# EAGLE design ch446q-breakout (EAGLE 7.7.0)
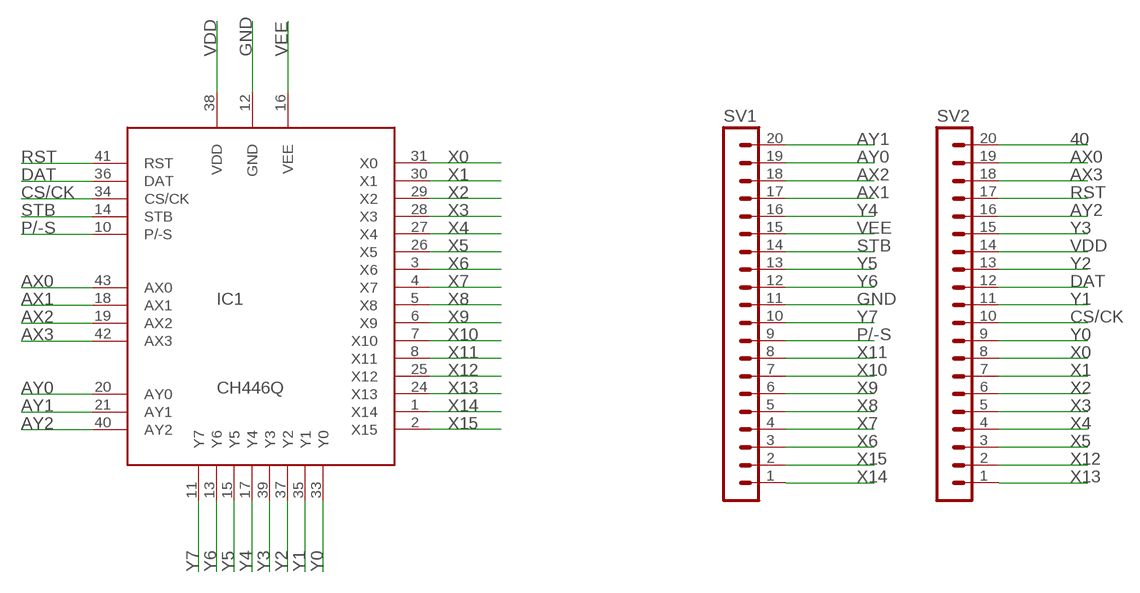
[diagram p0: schematic, sheet 1]

## Parts
IC1  CH446Q  [LQFP-44-J]
SV1  MA20-1JC  [MA20-1J]
SV2  MA20-1JC  [MA20-1J]

## Nets
40: SV2.20
AX0: IC1.43(AX0) SV2.19
AX1: IC1.18(AX1) SV1.17
AX2: IC1.19(AX2) SV1.18
AX3: IC1.42(AX3) SV2.18
AY0: IC1.20(AY0) SV1.19
AY1: IC1.21(AY1) SV1.20
AY2: IC1.40(AY2) SV2.16
CS/CK: IC1.34(CS/CK) SV2.10
DAT: IC1.36(DAT) SV2.12
GND: IC1.12(GND) SV1.11
P/-S: IC1.10(P/-S) SV1.9
RST: IC1.41(RST) SV2.17
STB: IC1.14(STB) SV1.14
VDD: IC1.38(VDD) SV2.14
VEE: IC1.16(VEE) SV1.15
X0: IC1.31(X0) SV2.8
X1: IC1.30(X1) SV2.7
X2: IC1.29(X2) SV2.6
X3: IC1.28(X3) SV2.5
X4: IC1.27(X4) SV2.4
X5: IC1.26(X5) SV2.3
X6: IC1.3(X6) SV1.3
X7: IC1.4(X7) SV1.4
X8: IC1.5(X8) SV1.5
X9: IC1.6(X9) SV1.6
X10: IC1.7(X10) SV1.7
X11: IC1.8(X11) SV1.8
X12: IC1.25(X12) SV2.2
X13: IC1.24(X13) SV2.1
X14: IC1.1(X14) SV1.1
X15: IC1.2(X15) SV1.2
Y0: IC1.33(Y0) SV2.9
Y1: IC1.35(Y1) SV2.11
Y2: IC1.37(Y2) SV2.13
Y3: IC1.39(Y3) SV2.15
Y4: IC1.17(Y4) SV1.16
Y5: IC1.15(Y5) SV1.13
Y6: IC1.13(Y6) SV1.12
Y7: IC1.11(Y7) SV1.10

## Library data of the parts
IC1 = joakim:CH446Q: 8x16 matrix analog switch chip, contains 128 analog switches, used for arbitrary routing of 8x16 signal channels. CH446 supports 4V to 12V single supply voltage, and supports +5V and -7V dual power supply voltage. The ON resistance is not greater than 65Ω. https://www.wch-ic.com/downloads/CH446DS1_PDF.html
SV1 SV2 = joakim:MA20-1J: PIN HEADER; OC_FARNELL: unknown; OC_NEWARK: unknown

## Board
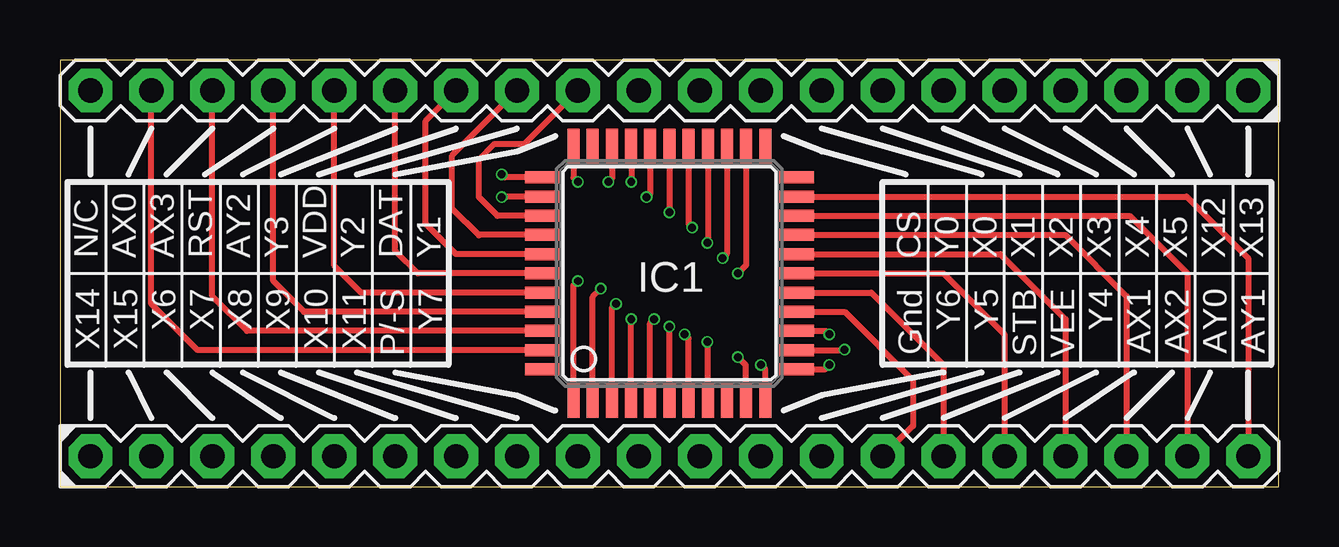
[diagram p1: board, top side]
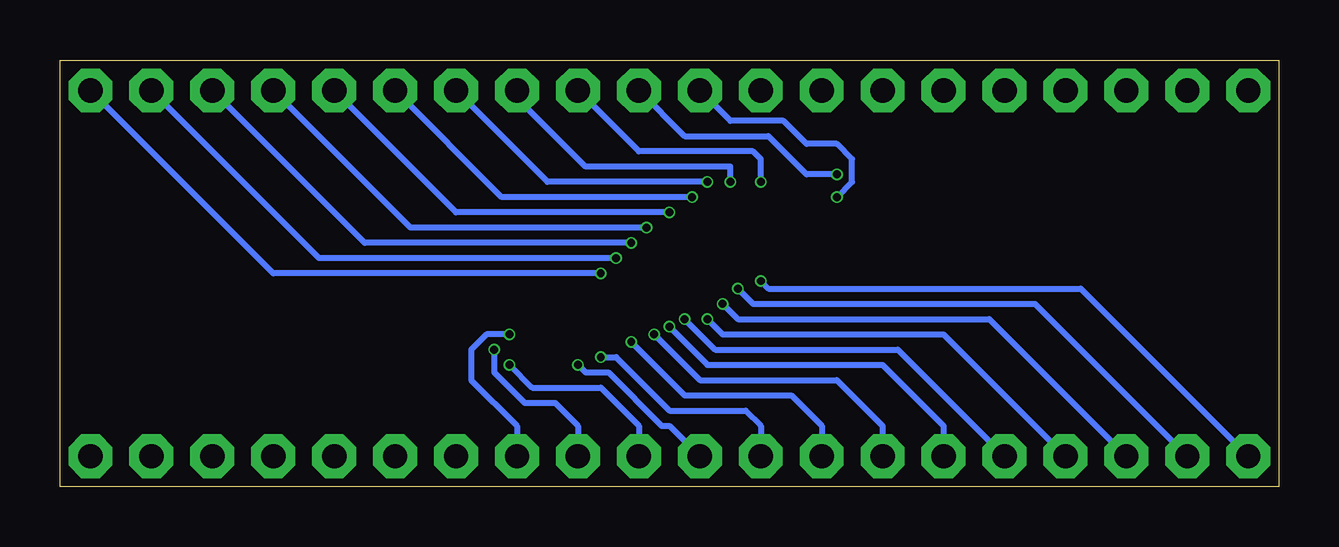
[diagram p2: board, bottom side, seen from below]

Size 50.8 x 17.78 mm. Coordinates in mm from the lower left corner, seen from the top.
Outline: 0,0 50.8,0 50.8,17.78 0,17.78 0,0
Copper layers (1*16): Top 0.035mm / dielectric 1.6mm / Bottom 0.035mm
Design rules "jlcpcb-2layers": minimum track width 5mil, minimum drill 0.3mm, track to track 5mil, track to pad 5mil, pad to pad 5mil, via to via 5mil, smd to smd 5mil, copper to edge 0.2mm, drill to drill 6mil, minimum pad ring 10mil, minimum via ring 3mil, stop-mask expansion 4mil, vias tented up to drill 0mil, thermal gap 10mil

### Footprints (pad centres in the part's own frame; a part is rotated, then mirrored left to right if it is on the bottom)
LQFP-44-J = smd 0.5 x 1.45: 1 -4,-5.3; 2 -3.2,-5.3; 3 -2.4,-5.3; 4 -1.6,-5.3; 5 -0.8,-5.3; 6 0,-5.3; 7 0.8,-5.3; 8 1.6,-5.3; 9 2.4,-5.3; 10 3.2,-5.3; 11 4,-5.3; 23 4,5.3; 24 3.2,5.3; 25 2.4,5.3; 26 1.6,5.3; 27 0.8,5.3; 28 0,5.3; 29 -0.8,5.3; 30 -1.6,5.3; 31 -2.4,5.3; 32 -3.2,5.3; 33 -4,5.3 | smd 1.45 x 0.5: 12 5.3,-4; 13 5.3,-3.2; 14 5.3,-1.6; 15 5.3,-2.4; 16 5.3,-0.8; 17 5.3,0; 18 5.3,0.8; 19 5.3,1.6; 20 5.3,2.4; 21 5.3,3.2; 22 5.3,4; 34 -5.3,4; 35 -5.3,3.2; 36 -5.3,2.4; 37 -5.3,1.6; 38 -5.3,0.8; 39 -5.3,0; 40 -5.3,-0.8; 41 -5.3,-1.6; 42 -5.3,-2.4; 43 -5.3,-3.2; 44 -5.3,-4
MA20-1J = drill 1.016 octagon: 1 -24.13,0; 2 -21.59,0; 3 -19.05,0; 4 -16.51,0; 5 -13.97,0; 6 -11.43,0; 7 -8.89,0; 8 -6.35,0; 9 -3.81,0; 10 -1.27,0; 11 1.27,0; 12 3.81,0; 13 6.35,0; 14 8.89,0; 15 11.43,0; 16 13.97,0; 17 16.51,0; 18 19.05,0; 19 21.59,0; 20 24.13,0

### Placement (x,y rotation side)
IC1  25.4,8.89 0 top
SV1  25.4,1.27 0 top
SV2  25.4,16.51 180 top

### Tracks (layer width: path | path; a pad name or v marks a point on that pad's centre or on a via)
AX0
  Top 0.254: IC1.43 5.74,5.69 3.81,7.62 SV2.19
AX1
  Top 0.254: IC1.18 39.2,9.69 41.91,6.99 SV1.17
AX2
  Top 0.254: IC1.19 41.9,10.49 44.45,7.94 SV1.18
AX3
  Top 0.254: IC1.42 7.8,6.49 6.35,7.94 SV2.18
AY0
  Top 0.254: IC1.20 44.59,11.29 46.99,8.89 SV1.19
AY1
  Top 0.254: IC1.21 46.97,12.09 49.53,9.53 SV1.20
AY2
  Top 0.254: IC1.40 12.55,8.09 11.43,9.21 SV2.16
CS/CK  (via drill 0.33)
  Top 0.254: IC1.34 18.54,12.89 v18.41,13.02
  Bottom 0.254: v18.41,13.02 19.68,13.02 21.27,14.61 24.77,14.61 SV2.10
DAT
  Top 0.254: IC1.36 18.24,11.29 17.46,12.06 17.46,13.65 18.1,14.29 19.37,14.29 SV2.12
GND  (via drill 0.33)
  Top 0.254: IC1.12 31.88,4.89 v32.07,5.08
  Bottom 0.254: v32.07,5.08 31.11,4.13 28.26,4.13 26.67,2.54 SV1.11
P/-S  (via drill 0.33)
  Top 0.254: IC1.10 28.57,3.62 28.57,5.08 v28.26,5.4
  Bottom 0.254: v28.26,5.4 27.62,5.4 25.4,3.17 22.23,3.17 21.59,2.54 SV1.9
RST
  Top 0.254: IC1.41 10.17,7.29 8.89,8.57 SV2.17
STB
  Top 0.254: IC1.14 32.72,7.29 35.56,4.45 35.56,2.54 SV1.14
VDD
  Top 0.254: IC1.38 16.51,9.69 15.24,10.96 15.24,15.24 SV2.14
VEE
  Top 0.254: IC1.16 33.82,8.09 36.83,5.08 SV1.15
X0  (via drill 0.33)
  Top 0.254: IC1.31 23,12.84 v22.86,12.7
  Bottom 0.254: v22.86,12.7 22.86,13.34 28.89,13.34 31.75,16.19 SV2.8
X1  (via drill 0.33)
  Top 0.254: IC1.30 23.81,14.18 v23.81,12.7
  Bottom 0.254: v23.81,12.7 30.48,12.7 SV2.7
X2  (via drill 0.33)
  Top 0.254: IC1.29 24.6,12.22 v24.45,12.06
  Bottom 0.254: v24.45,12.06 32.38,12.06 SV2.6
X3  (via drill 0.33)
  Top 0.254: IC1.28 v25.4,11.43
  Bottom 0.254: v25.4,11.43 34.29,11.43 SV2.5
X4  (via drill 0.33)
  Top 0.254: IC1.27 26.2,10.95 v26.35,10.79
  Bottom 0.254: v26.35,10.79 36.2,10.79 SV2.4
X5  (via drill 0.33)
  Top 0.254: IC1.26 27,10.17 v26.99,10.16
  Bottom 0.254: v26.99,10.16 38.1,10.16 SV2.3
X6  (via drill 0.33)
  Top 0.254: IC1.3 23,7.44 v23.18,7.62
  Bottom 0.254: v23.18,7.62 22.54,6.99 12.06,6.99 SV1.3
X7  (via drill 0.33)
  Top 0.254: IC1.4 23.8,6.97 v23.81,6.99
  Bottom 0.254: v23.81,6.99 23.18,6.35 13.97,6.35 SV1.4
X8  (via drill 0.33)
  Top 0.254: IC1.5 24.6,6.82 v24.77,6.99
  Bottom 0.254: v24.77,6.99 23.5,5.71 15.88,5.71 SV1.5
X9  (via drill 0.33)
  Top 0.254: IC1.6 v25.4,6.67
  Bottom 0.254: v25.4,6.67 23.81,5.08 16.51,5.08 13.97,2.54 SV1.6
X10  (via drill 0.33)
  Top 0.254: IC1.7 26.2,6.18 v26.04,6.35
  Bottom 0.254: v26.04,6.35 24.13,4.45 18.41,4.45 16.51,2.54 SV1.7
X11  (via drill 0.33)
  Top 0.254: IC1.8 v27,6.02 v26.99,6.03
  Bottom 0.254: v26.99,6.03 24.77,3.81 20.32,3.81 19.05,2.54 SV1.8
X12  (via drill 0.33)
  Top 0.254: IC1.25 27.8,9.7 v27.62,9.53
  Bottom 0.254: v27.62,9.53 40.01,9.53 SV2.2
X13  (via drill 0.33)
  Top 0.254: IC1.24 28.6,9.23 v28.26,8.89
  Bottom 0.254: v28.26,8.89 41.91,8.89 SV2.1
X14  (via drill 0.33)
  Top 0.254: IC1.1 21.4,8.38 v21.59,8.57
  Bottom 0.254: v21.59,8.57 21.27,8.26 8.26,8.26 SV1.1
X15  (via drill 0.33)
  Top 0.254: IC1.2 22.2,7.91 v22.54,8.26
  Bottom 0.254: v22.54,8.26 21.91,7.62 10.16,7.62 SV1.2
Y0  (via drill 0.33)
  Top 0.254: IC1.33 21.4,12.89 v21.59,12.7
  Bottom 0.254: v21.59,12.7 21.59,13.65 21.91,13.97 26.67,13.97 SV2.9
Y1  (via drill 0.33)
  Top 0.254: IC1.35 18.44,12.09 v18.41,12.06
  Bottom 0.254: v18.41,12.06 17.78,12.7 17.78,13.65 18.41,14.29 19.68,14.29 20.64,15.24 22.86,15.24 SV2.11
Y2
  Top 0.254: IC1.37 17.48,10.49 17.46,10.48 16.35,11.59 16.35,13.81 SV2.13
Y3
  Top 0.254: IC1.39 14.92,8.89 13.97,9.84 SV2.15
Y4
  Top 0.254: IC1.17 36.83,8.89 39.37,6.35 SV1.16
Y5  (via drill 0.33)
  Top 0.254: IC1.15 31.93,6.49 v32.07,6.35
  Bottom 0.254: v32.07,6.35 33.02,6.35 33.66,5.71 33.66,4.45 31.75,2.54 SV1.13
Y6  (via drill 0.33)
  Top 0.254: IC1.13 32.68,5.69 v32.7,5.71
  Bottom 0.254: v32.7,5.71 32.7,4.76 31.43,3.49 30.16,3.49 29.21,2.54 SV1.12
Y7  (via drill 0.33)
  Top 0.254: IC1.11 29.4,4.89 v29.21,5.08
  Bottom 0.254: v29.21,5.08 28.89,4.76 27.94,4.76 25.72,2.54 25.4,2.54 SV1.10

### Text on the board
tNames: N/C | AX0 | AX3 | RST | AY2 | Y3 | VDD | Y2 | DAT | Y1 | CS | Y0 | X0 | X1 | X2 | X3 | X4 | X5 | X12 | X13 | X14 | X15 | X6 | X7 | X8 | X9 | X10 | X11 | P/-S | Y7 | Gnd | Y6 | Y5 | STB | VEE | Y4 | AX1 | AX2 | AY0 | AY1